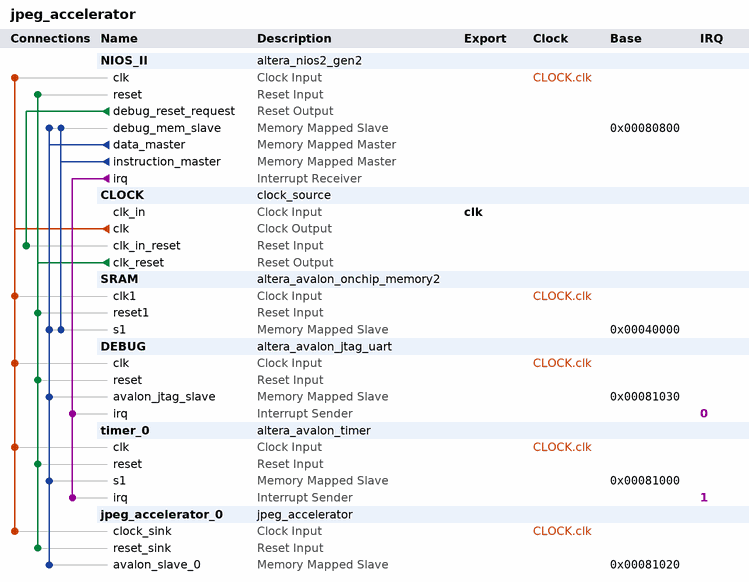
[diagram p0: system contents]
# Platform Designer (Qsys) system jpeg_accelerator, Cyclone V 5CSXFC6D6F31C6
# Parameters at their usual value, and those the tool derives, are not listed.
package require -exact qsys 18.1
create_system jpeg_accelerator
set_project_property DEVICE_FAMILY {Cyclone V}
set_project_property DEVICE 5CSXFC6D6F31C6

add_instance NIOS_II altera_nios2_gen2 18.1
set_instance_parameter_value NIOS_II dcache_size 2048
set_instance_parameter_value NIOS_II exceptionSlave SRAM.s1
set_instance_parameter_value NIOS_II icache_size 4096
set_instance_parameter_value NIOS_II impl Tiny
set_instance_parameter_value NIOS_II resetSlave SRAM.s1

add_instance CLOCK clock_source 18.1
set_instance_parameter_value CLOCK clockFrequency 50000000

add_instance SRAM altera_avalon_onchip_memory2 18.1
set_instance_parameter_value SRAM dataWidth 32
set_instance_parameter_value SRAM dualPort false
set_instance_parameter_value SRAM initMemContent true
set_instance_parameter_value SRAM initializationFileName onchip_mem.hex
set_instance_parameter_value SRAM memorySize 256000

add_instance DEBUG altera_avalon_jtag_uart 18.1
set_instance_parameter_value DEBUG simInteractiveOptions NO_INTERACTIVE_WINDOWS

add_instance timer_0 altera_avalon_timer 18.1
set_instance_parameter_value timer_0 period 1
set_instance_parameter_value timer_0 periodUnits MSEC

add_instance jpeg_accelerator_0 jpeg_accelerator 2.0

# connections
add_connection CLOCK.clk DEBUG.clk clock
add_connection CLOCK.clk jpeg_accelerator_0.clock_sink clock
add_connection CLOCK.clk NIOS_II.clk clock
add_connection CLOCK.clk SRAM.clk1 clock
add_connection CLOCK.clk timer_0.clk clock
add_connection CLOCK.clk_reset DEBUG.reset reset
add_connection CLOCK.clk_reset jpeg_accelerator_0.reset_sink reset
add_connection CLOCK.clk_reset NIOS_II.reset reset
add_connection CLOCK.clk_reset SRAM.reset1 reset
add_connection CLOCK.clk_reset timer_0.reset reset
add_connection NIOS_II.debug_reset_request CLOCK.clk_in_reset reset
add_connection NIOS_II.data_master DEBUG.avalon_jtag_slave avalon
set_connection_parameter_value NIOS_II.data_master/DEBUG.avalon_jtag_slave baseAddress 0x00081030
add_connection NIOS_II.data_master jpeg_accelerator_0.avalon_slave_0 avalon
set_connection_parameter_value NIOS_II.data_master/jpeg_accelerator_0.avalon_slave_0 baseAddress 0x00081020
add_connection NIOS_II.data_master NIOS_II.debug_mem_slave avalon
set_connection_parameter_value NIOS_II.data_master/NIOS_II.debug_mem_slave baseAddress 0x00080800
add_connection NIOS_II.data_master SRAM.s1 avalon
set_connection_parameter_value NIOS_II.data_master/SRAM.s1 baseAddress 0x00040000
add_connection NIOS_II.data_master timer_0.s1 avalon
set_connection_parameter_value NIOS_II.data_master/timer_0.s1 baseAddress 0x00081000
add_connection NIOS_II.instruction_master NIOS_II.debug_mem_slave avalon
set_connection_parameter_value NIOS_II.instruction_master/NIOS_II.debug_mem_slave baseAddress 0x00080800
add_connection NIOS_II.instruction_master SRAM.s1 avalon
set_connection_parameter_value NIOS_II.instruction_master/SRAM.s1 baseAddress 0x00040000
add_connection NIOS_II.irq DEBUG.irq interrupt
set_connection_parameter_value NIOS_II.irq/DEBUG.irq irqNumber 0
add_connection NIOS_II.irq timer_0.irq interrupt
set_connection_parameter_value NIOS_II.irq/timer_0.irq irqNumber 1

# exported interfaces
add_interface clk clock sink
set_interface_property clk EXPORT_OF CLOCK.clk_in

set_interconnect_requirement {$system} qsys_mm.clockCrossingAdapter HANDSHAKE
set_interconnect_requirement {$system} qsys_mm.enableEccProtection FALSE
set_interconnect_requirement {$system} qsys_mm.insertDefaultSlave FALSE
set_interconnect_requirement {$system} qsys_mm.maxAdditionalLatency 1

save_system jpeg_accelerator.qsys
